# Altium project Sensors.PrjPcb
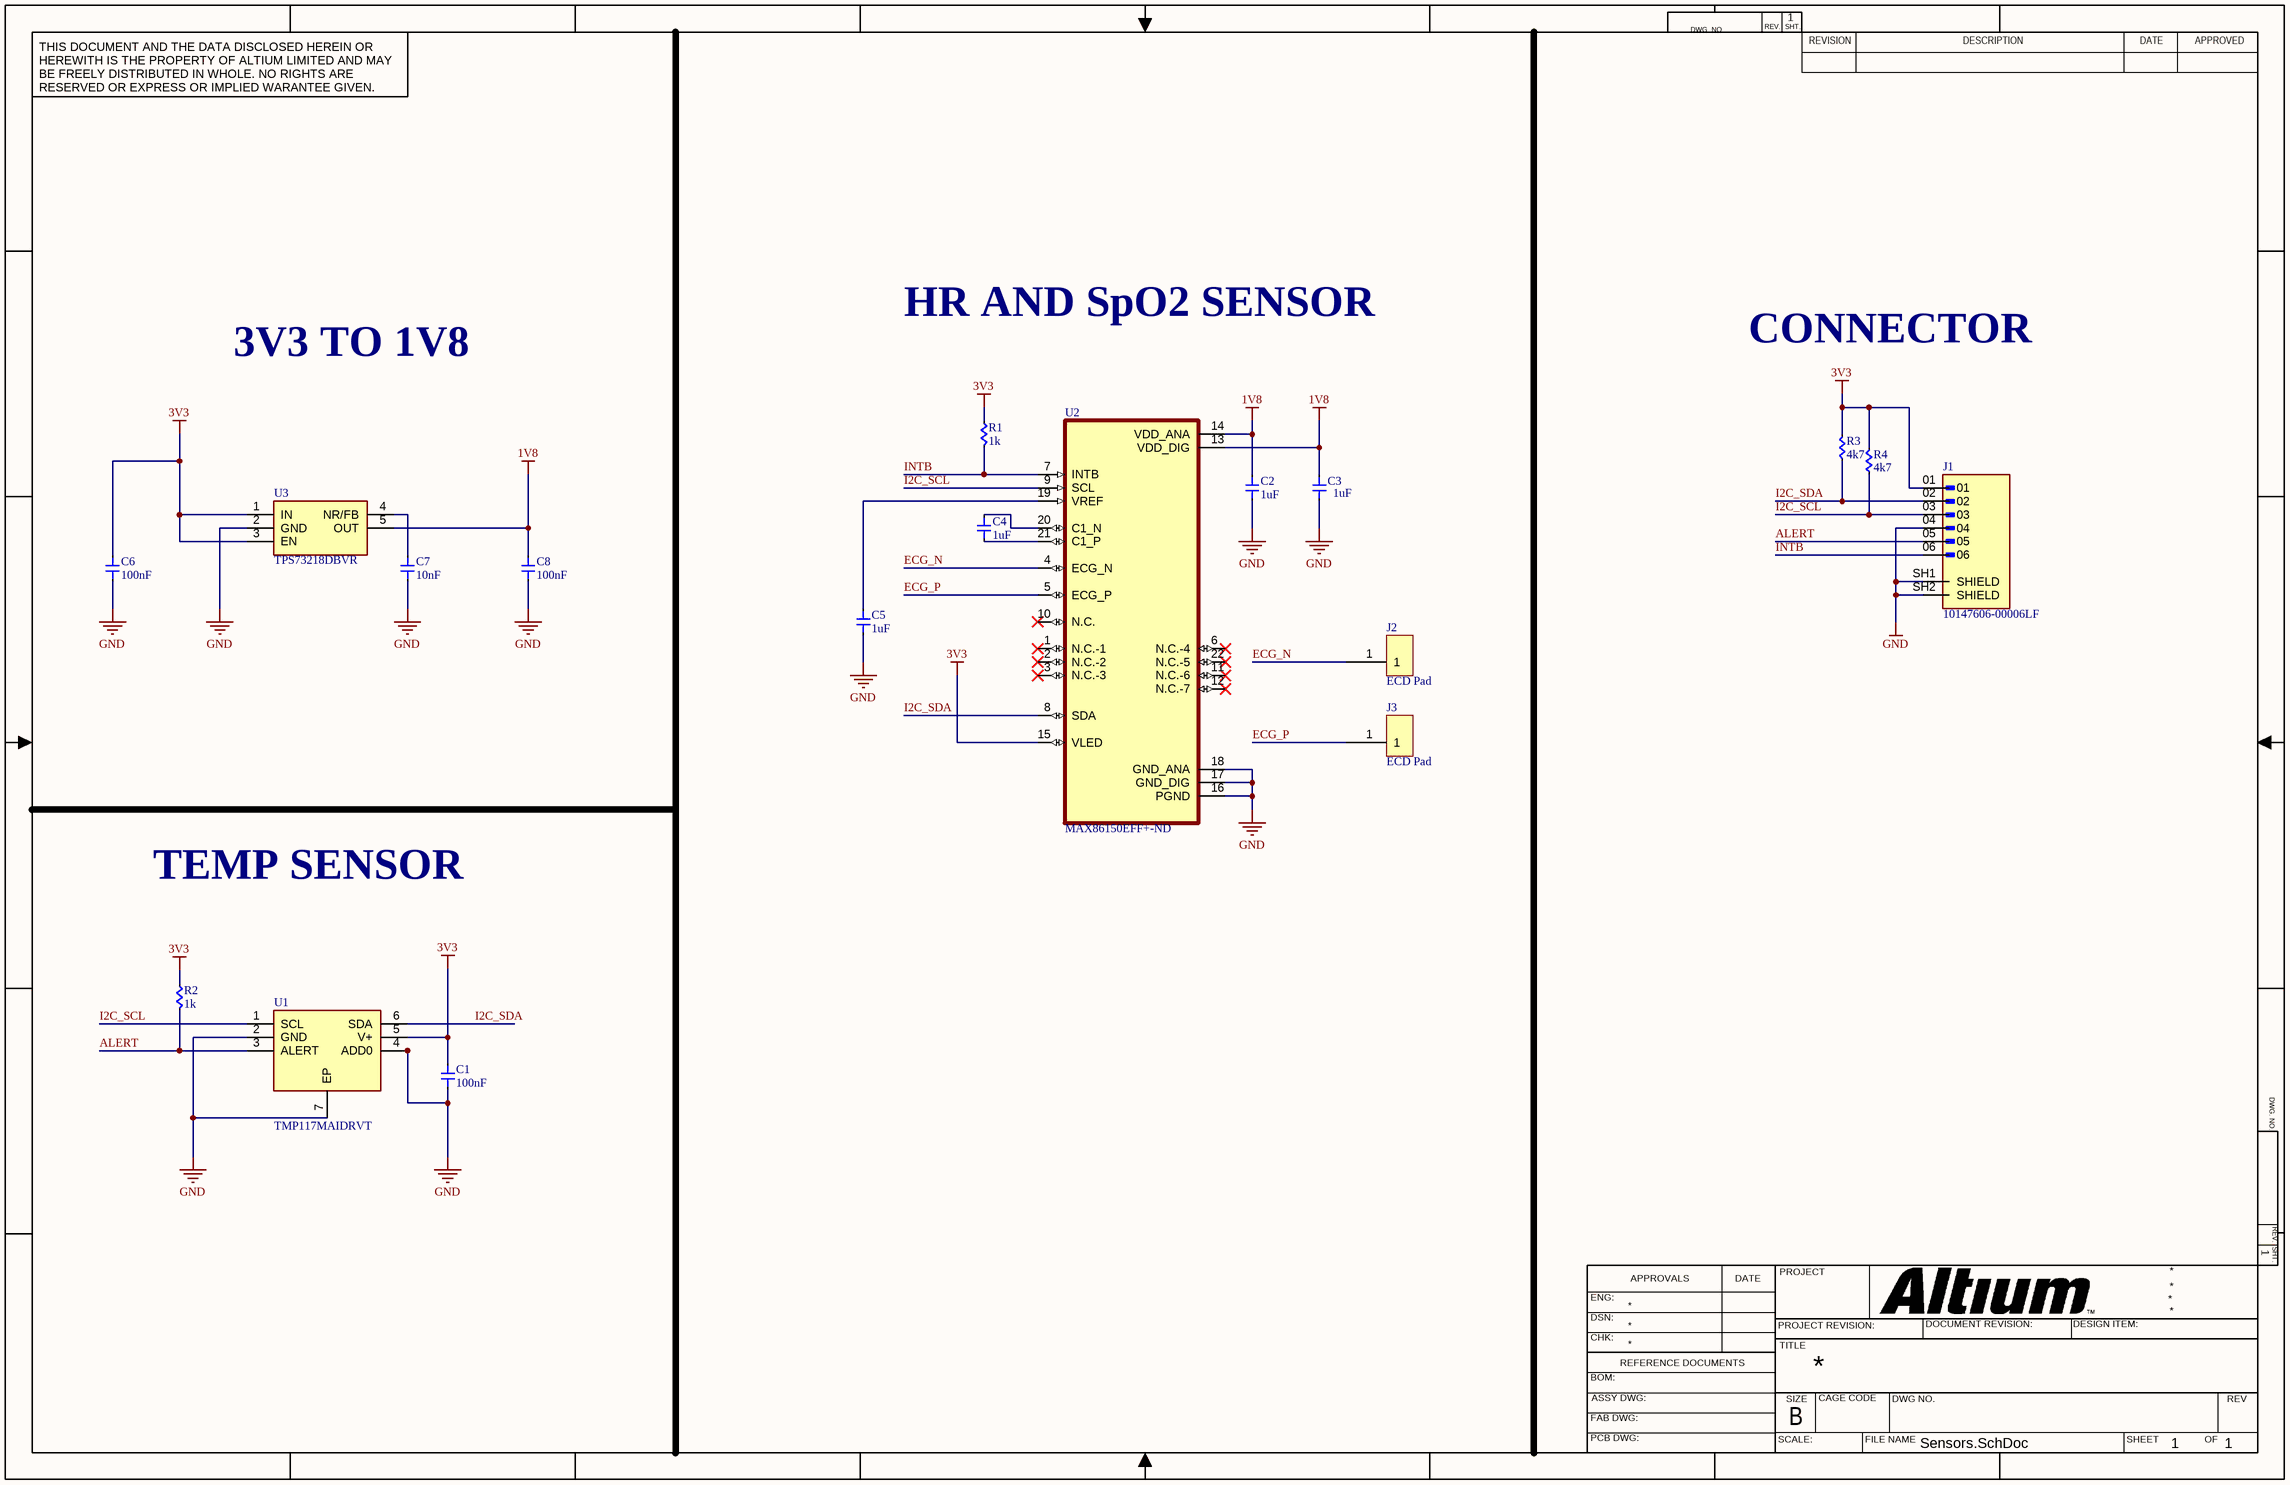
[diagram p0: Sensors.SchDoc]
1 sheet, 18 parts. Net scope: global (net labels, ports and power ports of the same name join across sheets).
Board file: Sensors.PcbDoc

## Sheet Sensors.SchDoc
size 431 x 279 mm; SheetNumber: 1; SheetTotal: 1

### Parts
C1  100nF  [Cap 0603]
C2  1uF  [Cap 0603]
C3  1uF  [Cap 0603]
C4  1uF  [Cap 0603]
C5  1uF  [Cap 0603]
C6  100nF  [Cap 0603]
C7  10nF  [Cap 0603]
C8  100nF  [Cap 0603]
J1  10147606-00006LF  [AMPHENOL_10147606-00006LF]
J2  ECD Pad  [ECG Pad]
J3  ECD Pad  [ECG Pad]
R1  1k  [RES 0402]
R2  1k  [RES 0402]
R3  4k7  [RES 0603]
R4  4k7  [RES 0603]
U1  TMP117MAIDRVT  [SON65P200X200X80-7N]
U2  MAX86150EFF+-ND  [MAX86150EFF+]
U3  TPS73218DBVR  [SOT95P280X145-5N]

### Nets
1V8: C2.1 C3.1 C8.1 U2.13(VDD_DIG) U2.14(VDD_ANA) U3.5(OUT)
3V3: C1.1 C6.1 J1.01 R1.1 R2.1 R3.2 R4.2 U1.5(V+) U2.15(VLED) U3.1(IN) U3.3(EN)
GND: C1.2 C2.2 C3.2 C5.2 C6.2 C7.2 C8.2 J1.04 J1.SH1(SHIELD) J1.SH2(SHIELD) U1.2(GND) U1.4(ADD0) U1.7(EP) U2.16(PGND) U2.17(GND_DIG) U2.18(GND_ANA) U3.2(GND)
ALERT: J1.05 R2.2 U1.3(ALERT)
ECG_N: J2.1 U2.4(ECG_N)
ECG_P: J3.1 U2.5(ECG_P)
I2C_SCL: J1.03 R4.1 U1.1(SCL) U2.9(SCL)
I2C_SDA: J1.02 R3.1 U1.6(SDA) U2.8(SDA)
INTB: J1.06 R1.2 U2.7(INTB)
NetC4_1: C4.1 U2.20(C1_N)
NetC4_2: C4.2 U2.21(C1_P)
NetC5_1: C5.1 U2.19(VREF)
NetC7_1: C7.1 U3.4(NR/FB)

Not connected (* = marked no-connect by the designer): U2 1(N.C.-1)* 2(N.C.-2)* 3(N.C.-3)* 6(N.C.-4)* 10(N.C.)* 11(N.C.-6)* 12(N.C.-7)* 22(N.C.-5)*

### Notes on the sheet
- 3V3 TO 1V8
- HR AND SpO2 SENSOR
- CONNECTOR
- TEMP SENSOR
- DWG. NO.
- REV.
- SHT.
- THIS DOCUMENT AND THE DATA DISCLOSED HEREIN OR HEREWITH IS THE PROPERTY OF ALTIUM LIMITED AND MAY BE FREELY DISTRIBUTED IN WHOLE. NO RIGHTS ARE RESERVED OR EXPRESS OR IMPLIED WARANTEE GIVEN.
- REVISION
- DESCRIPTION
- DATE
- APPROVED
- ENG:
- APPROVALS
- PROJECT
- DSN:
- CHK:
- REFERENCE DOCUMENTS
- PROJECT REVISION:
- TITLE
- DOCUMENT REVISION:
- DESIGN ITEM:
- BOM:
- FAB DWG:
- PCB DWG:
- ASSY DWG:
- SCALE:
- SIZE
- B
- CAGE CODE
- FILE NAME
- DWG NO.
- SHEET
- OF
- REV

### Library data of the parts
C1-C8 = Cap 0603: Capacitor SMD 0603
J1 = 10147606-00006LF: Minitek 1.0mm R/A SMT Header, 6 Positions, Tin Plating, Natural Color; MF: Amphenol; SnapEDA_Link: https://www.snapeda.com/parts/10147606-00006LF/Amphenol/view-part/?ref=snap; Package: None; Value: *; MP: 10147606-00006LF; Check_prices: https://www.snapeda.com/parts/10147606-00006LF/Amphenol/view-part/?ref=eda
J2 J3 = ECG Pad: 1cm x 1cm ECG Pad
R1 R2 = RES 0402: RES SMD 0402; Manufacturer: Vishay Dale; Manufacturer Part Number: CRCW040210K0FKED; Resistance (Ohms): 10k; Tolerance: ±1%; Power (Watts): 0.063W, 1/16W; Temperature Coefficient: ±100ppm/°C; Supplier 1: Digi-Key; RoHS: RoHS Compliant; Category: Resistors; Stock 1: 2392462; Pricing 1: 10=0.083, 50=0.0444, 200=0.0255, 1000=0.0174 (USD); Packaging: Cut Tape (CT); Composition: Thick Film; Features: Automotive AEC-Q200; Operating Temperature: -55°C ~ 155°C; Package / Case: 0402 (1005 Metric); Supplier Device Package: 0402 (1005 Metric); Size / Dimension: 0.039" L x 0.020" W (1.00mm x 0.50mm); Height: 0.016" (0.40mm); Number of Terminations: 2; ComponentLink1URL: http://www.vishay.com/docs/20035/dcrcwe3.pdf; ComponentLink1Description: http://www.vishay.com/docs/20035/dcrcwe3.pdf; Supplier Part Number 1: 541-10.0KLCT-ND
R3 R4 = RES 0603: RES SMD 0603; Manufacturer: Vishay Dale; Manufacturer Part Number: CRCW040210K0FKED; Resistance (Ohms): 10k; Tolerance: ±1%; Power (Watts): 0.063W, 1/16W; Temperature Coefficient: ±100ppm/°C; Supplier 1: Digi-Key; RoHS: RoHS Compliant; Category: Resistors; Stock 1: 2392462; Pricing 1: 10=0.083, 50=0.0444, 200=0.0255, 1000=0.0174 (USD); Packaging: Cut Tape (CT); Composition: Thick Film; Features: Automotive AEC-Q200; Operating Temperature: -55°C ~ 155°C; Package / Case: 0402 (1005 Metric); Supplier Device Package: 0402 (1005 Metric); Size / Dimension: 0.039" L x 0.020" W (1.00mm x 0.50mm); Height: 0.016" (0.40mm); Number of Terminations: 2; ComponentLink1URL: http://www.vishay.com/docs/20035/dcrcwe3.pdf; ComponentLink1Description: http://www.vishay.com/docs/20035/dcrcwe3.pdf; Supplier Part Number 1: 541-10.0KLCT-ND
U1 = TMP117MAIDRVT: Integrated Circuit; Manufacturer_Name: Texas Instruments; Datasheet Link: http://www.ti.com/lit/ds/symlink/tmp117.pdf; Height: 0.8mm; Manufacturer_Part_Number: TMP117MAIDRVT; Mouser Part Number: 595-TMP117MAIDRVT; Mouser Price/Stock: https://www.mouser.co.uk/ProductDetail/Texas-Instruments/TMP117MAIDRVT?qs=qSfuJ%252Bfl%2Fd7%252B0%2FufpTVPxA%3D%3D; Arrow Part Number: TMP117MAIDRVT; Arrow Price/Stock: https://www.arrow.com/en/products/tmp117maidrvt/texas-instruments?utm_currency=USD&region=nac
U2 = MAX86150EFF+T: SENSOR - OXIMETER/HEART RATE I2C; MF: Analog Devices; SnapEDA_Link: https://www.snapeda.com/parts/MAX86150EFF+/Analog+Devices/view-part/?ref=snap; Package: OLGA-22 Maxim; Value: *; MP: MAX86150EFF+; Check_prices: https://www.snapeda.com/parts/MAX86150EFF+/Analog+Devices/view-part/?ref=eda
U3 = TPS73218DBVR: Integrated Circuit; Manufacturer_Name: Texas Instruments; Datasheet Link: http://www.ti.com/lit/gpn/TPS732; Height: 1.45mm; Manufacturer_Part_Number: TPS73218DBVR; Mouser Part Number: 595-TPS73218DBVR; Mouser Price/Stock: https://www.mouser.com/Search/Refine.aspx?Keyword=595-TPS73218DBVR